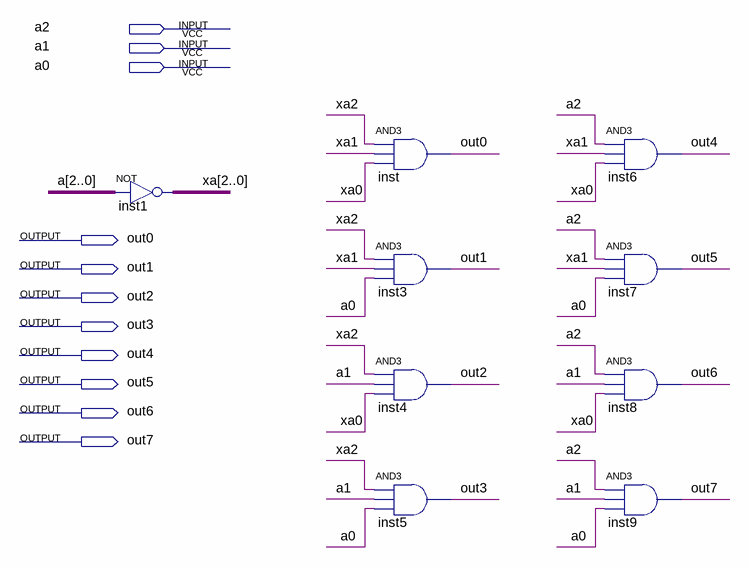
[diagram p0: schematic sheet]
// Quartus schematic pfs_decod_3x8.bdf as structural Verilog: 9 symbols, 11 pins
module pfs_decod_3x8 (
  input  a2,
  input  a1,
  input  a0,
  output out0,
  output out1,
  output out2,
  output out3,
  output out4,
  output out5,
  output out6,
  output out7
);

  wire [2:0] xa;

  assign xa = ~{a2, a1, a0};  // NOT inst1, 3 bits wide
  and inst (out0, xa[2], xa[1], xa[0]);
  and inst3 (out1, xa[2], xa[1], a0);
  and inst4 (out2, xa[2], a1, xa[0]);
  and inst5 (out3, xa[2], a1, a0);
  and inst6 (out4, a2, xa[1], xa[0]);
  and inst7 (out5, a2, xa[1], a0);
  and inst8 (out6, a2, a1, xa[0]);
  and inst9 (out7, a2, a1, a0);
endmodule
